# EAGLE design 3rd_ESC (EAGLE 7.2.0)
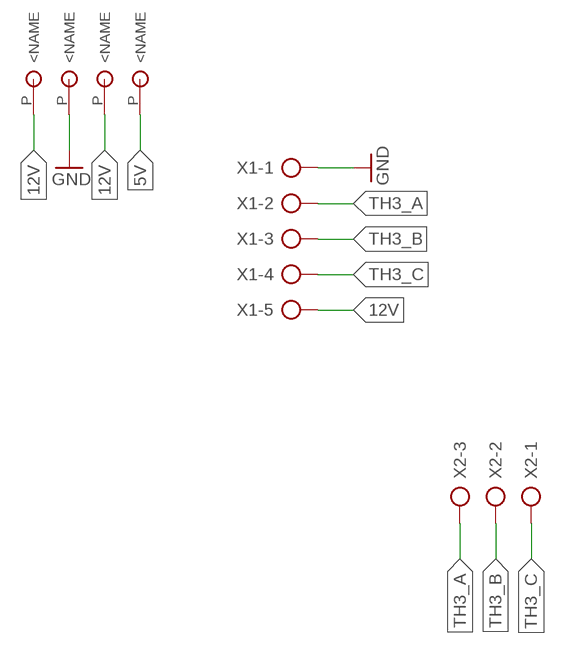
[diagram p0: schematic, sheet 1]

## Parts
U$1  CU-SPACER  [CU-SPACER]
U$2  CU-SPACER  [CU-SPACER]
U$3  CU-SPACER  [CU-SPACER]
U$4  CU-SPACER  [CU-SPACER]
X1  AK500/5  [AK500/5]
X2  AK500/3  [AK500/3]

## Nets
5V: U$4.P(<NAME)
12V: U$1.P(<NAME) U$3.P(<NAME) X1.5
GND: U$2.P(<NAME) X1.1
TH3_A: X1.2 X2.3
TH3_B: X1.3 X2.2
TH3_C: X1.4 X2.1

## Library data of the parts
U$1-U$4 = Aquaphoton:CU-SPACER
X1 = con-ptr500:AK500/5: CONNECTOR; OC_FARNELL: unknown; OC_NEWARK: unknown
X2 = con-ptr500:AK500/3: CONNECTOR; OC_FARNELL: unknown; OC_NEWARK: unknown

## Board
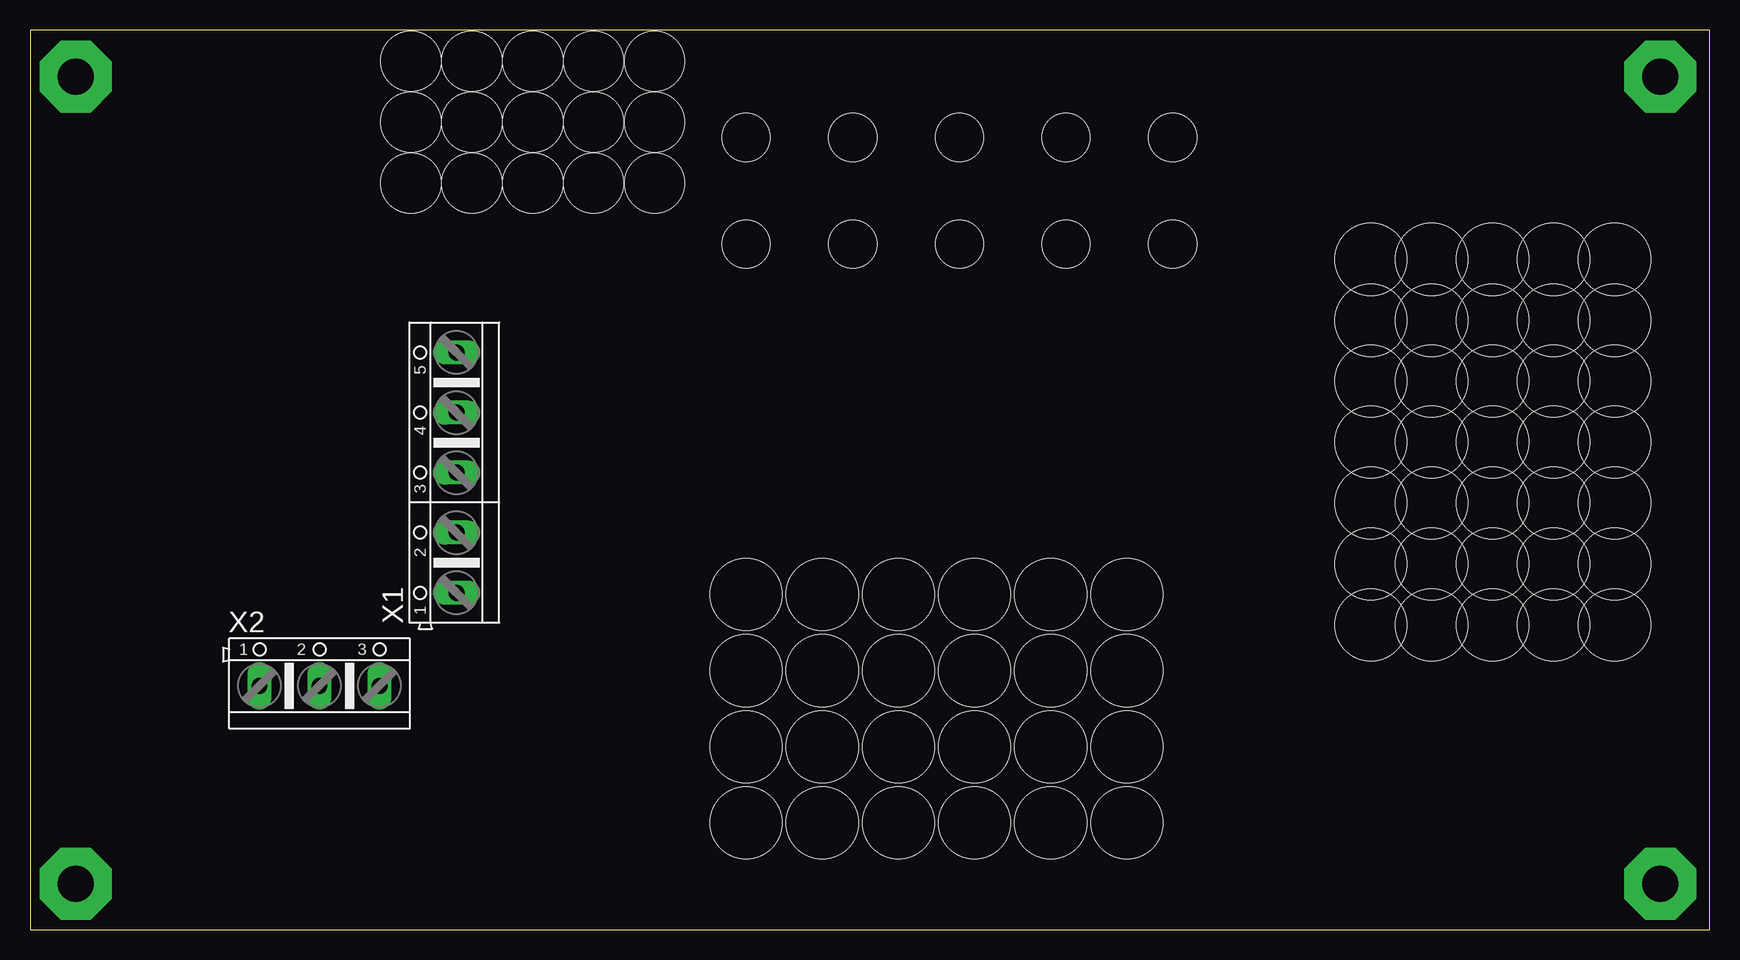
[diagram p1: board, top side]
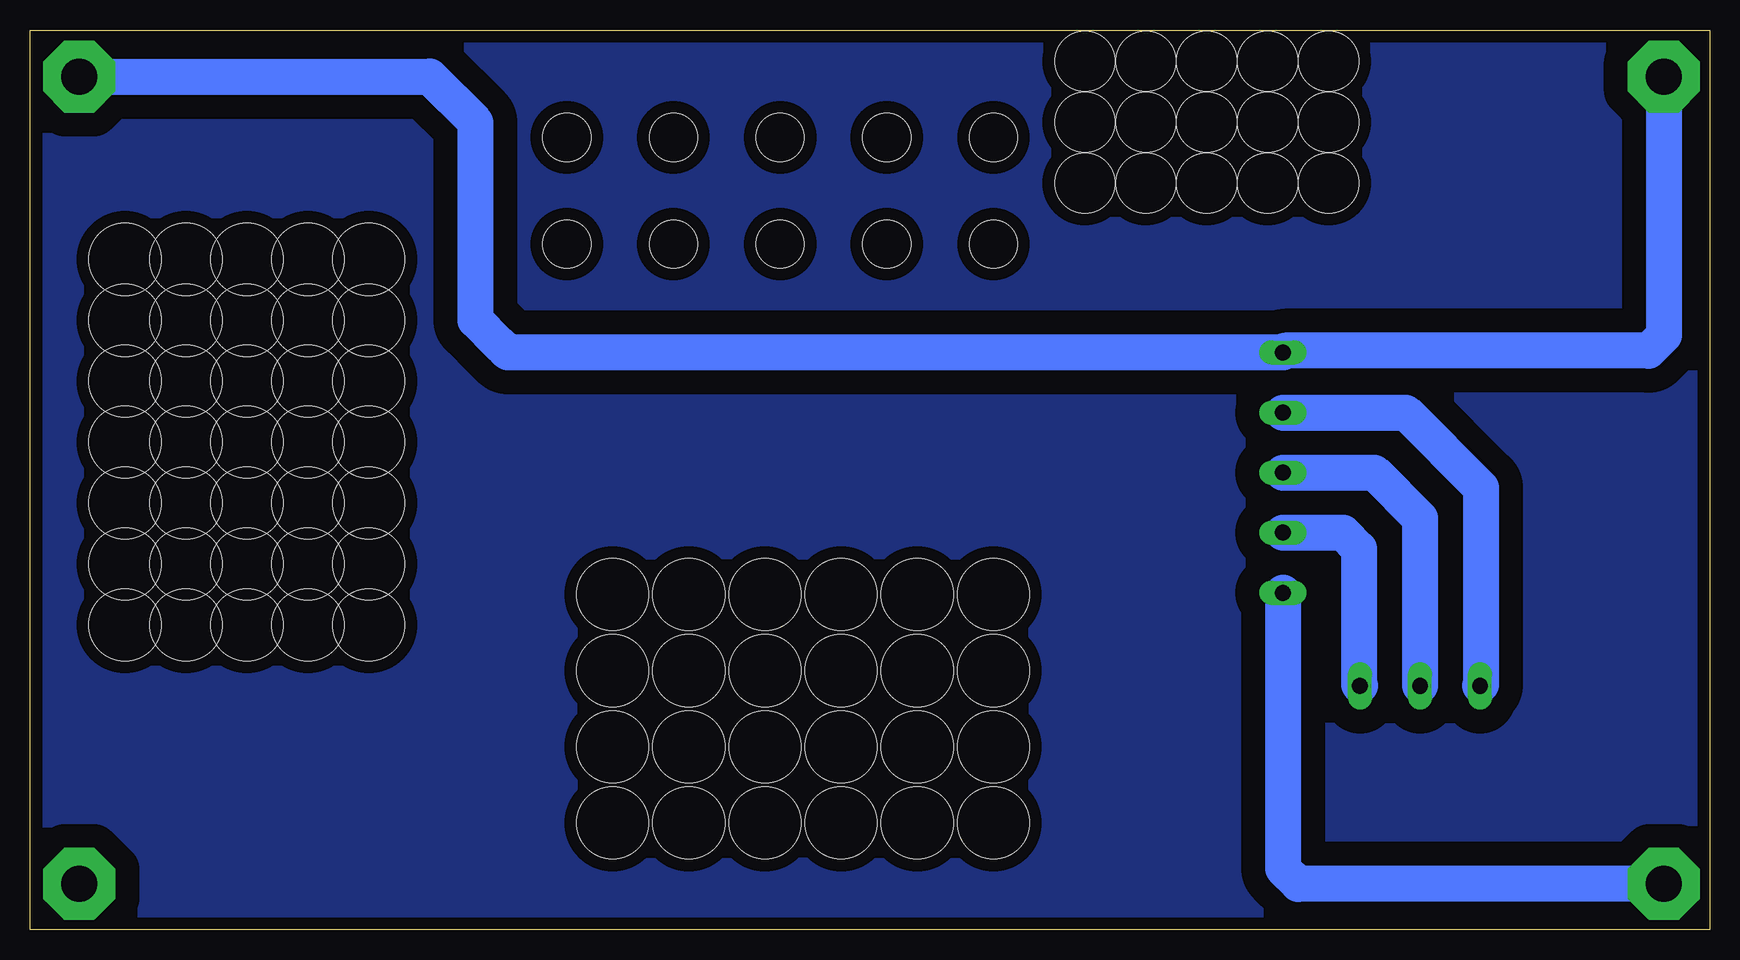
[diagram p2: board, bottom side, seen from below]

Size 140 x 75 mm. Coordinates in mm from the lower left corner, seen from the top.
Outline: 0,0 140,0 140,75 0,75 0,0
Copper layers (1*16): Top 0.035mm / dielectric 1.5mm / Bottom 0.035mm
Design rules "default *": minimum track width 10mil, minimum drill 24mil, track to track 2mm, track to pad 2mm, pad to pad 8mil, via to via 8mil, smd to smd 8mil, copper to edge 40mil, drill to drill 8mil, minimum pad ring 10mil, minimum via ring 8mil, stop-mask expansion 4mil, vias tented up to drill 0mil, thermal gap 10mil
Holes 6 mm at 116.84,55.88 121.92,55.88 127,55.88 132.08,55.88 116.84,50.8 116.84,45.72 116.84,40.64 116.84,35.56 116.84,30.48 121.92,30.48 127,30.48 132.08,30.48 121.92,35.56 121.92,40.64 121.92,45.72 121.92,50.8 127,50.8 127,45.72 127,40.64 127,35.56 132.08,35.56 132.08,40.64 132.08,45.72 132.08,50.8 59.69,21.59 66.04,21.59 72.39,21.59 78.74,21.59 59.69,15.24 66.04,15.24 72.39,15.24 78.74,15.24 59.69,8.89 66.04,8.89 72.39,8.89 78.74,8.89 59.69,27.94 66.04,27.94 72.39,27.94 78.74,27.94 85.09,27.94 85.09,21.59 85.09,15.24 85.09,8.89 91.44,27.94 91.44,21.59 91.44,15.24 91.44,8.89 116.84,25.4 121.92,25.4 127,25.4 132.08,25.4 111.76,55.88 111.76,50.8 111.76,45.72 111.76,40.64 111.76,35.56 111.76,30.48 111.76,25.4
Holes 4 mm at 59.69,66.04 59.69,57.15 68.58,66.04 68.58,57.15 77.47,66.04 77.47,57.15 86.36,66.04 86.36,57.15 95.25,66.04 95.25,57.15
Holes 5 mm at 31.75,62.23 36.83,62.23 36.83,67.31 36.83,72.39 41.91,62.23 41.91,67.31 41.91,72.39 46.99,62.23 46.99,67.31 46.99,72.39 31.75,67.31 31.75,72.39 52.07,62.23 52.07,67.31 52.07,72.39

### Footprints (pad centres in the part's own frame; a part is rotated, then mirrored left to right if it is on the bottom)
CU-SPACER = drill 3 pad 6 octagon: P 0,0
AK500/5 = drill 1.321 long: 1 -10.033,0; 2 -5.004,0; 3 0,0; 4 5.004,0; 5 10.008,0
AK500/3 = drill 1.321 long: 1 -5.004,0; 2 0,0; 3 5.004,0

### Placement (x,y rotation side)
U$1  135.89,71.12 0 top
U$2  3.81,3.81 0 top
U$3  3.81,71.12 0 top
U$4  135.89,3.81 0 top
X1  35.56,38.1 90 top
X2  24.13,20.32 0 top

### Tracks (layer width: path | path; a pad name or v marks a point on that pad's centre or on a via)
12V
  Bottom 3: U$3.P 3.81,49.53 5.08,48.26 35.41,48.26 X1.5 100.18,48.11 100.33,48.26 100.97,48.9 102.87,50.8 102.87,67.31 106.68,71.12 U$1.P
GND
  Bottom 3: U$2.P 34.29,3.81 35.56,5.08 X1.1
N$1
  pour Bottom: 0,74.93 139.7,74.93 139.7,0 0,0
TH3_A
  Bottom 3: X1.2 30.56,33.1 29.21,31.75 29.21,20.4 X2.3
TH3_B
  Bottom 3: X2.2 24.13,34.29 27.94,38.1 X1.3
TH3_C
  Bottom 3: X1.4 25.32,43.1 19.05,36.83 19.05,20.4 X2.1